# EAGLE schematic GPSTracker_v1.0 (EAGLE 7.2.0)
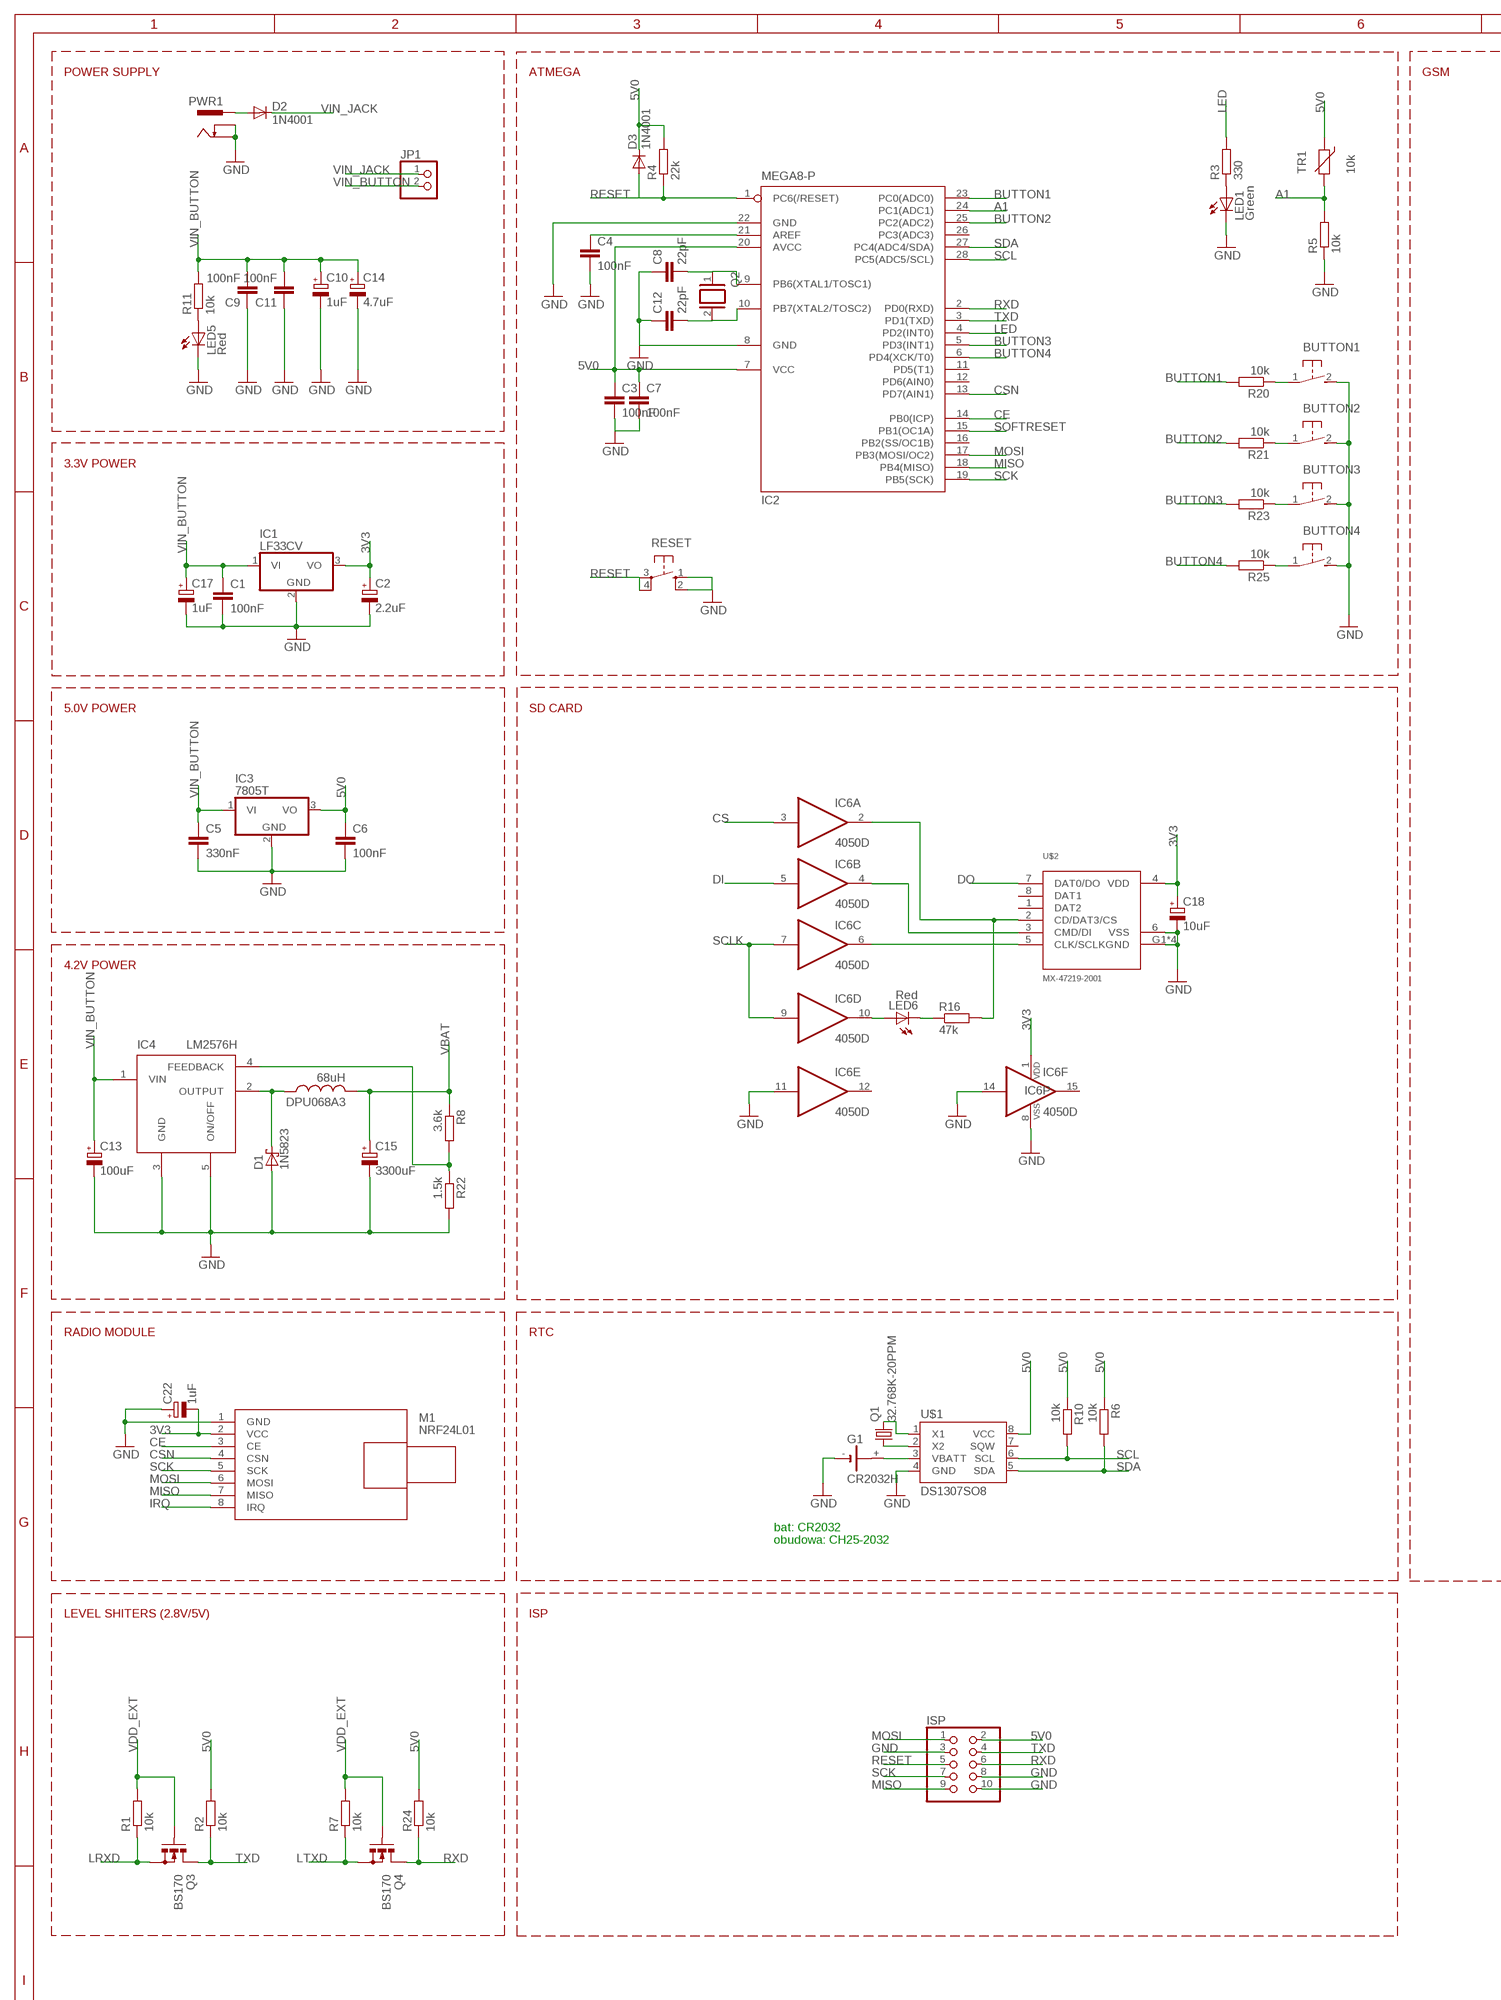
[diagram p0: schematic, sheet 1, part 1 of 2]
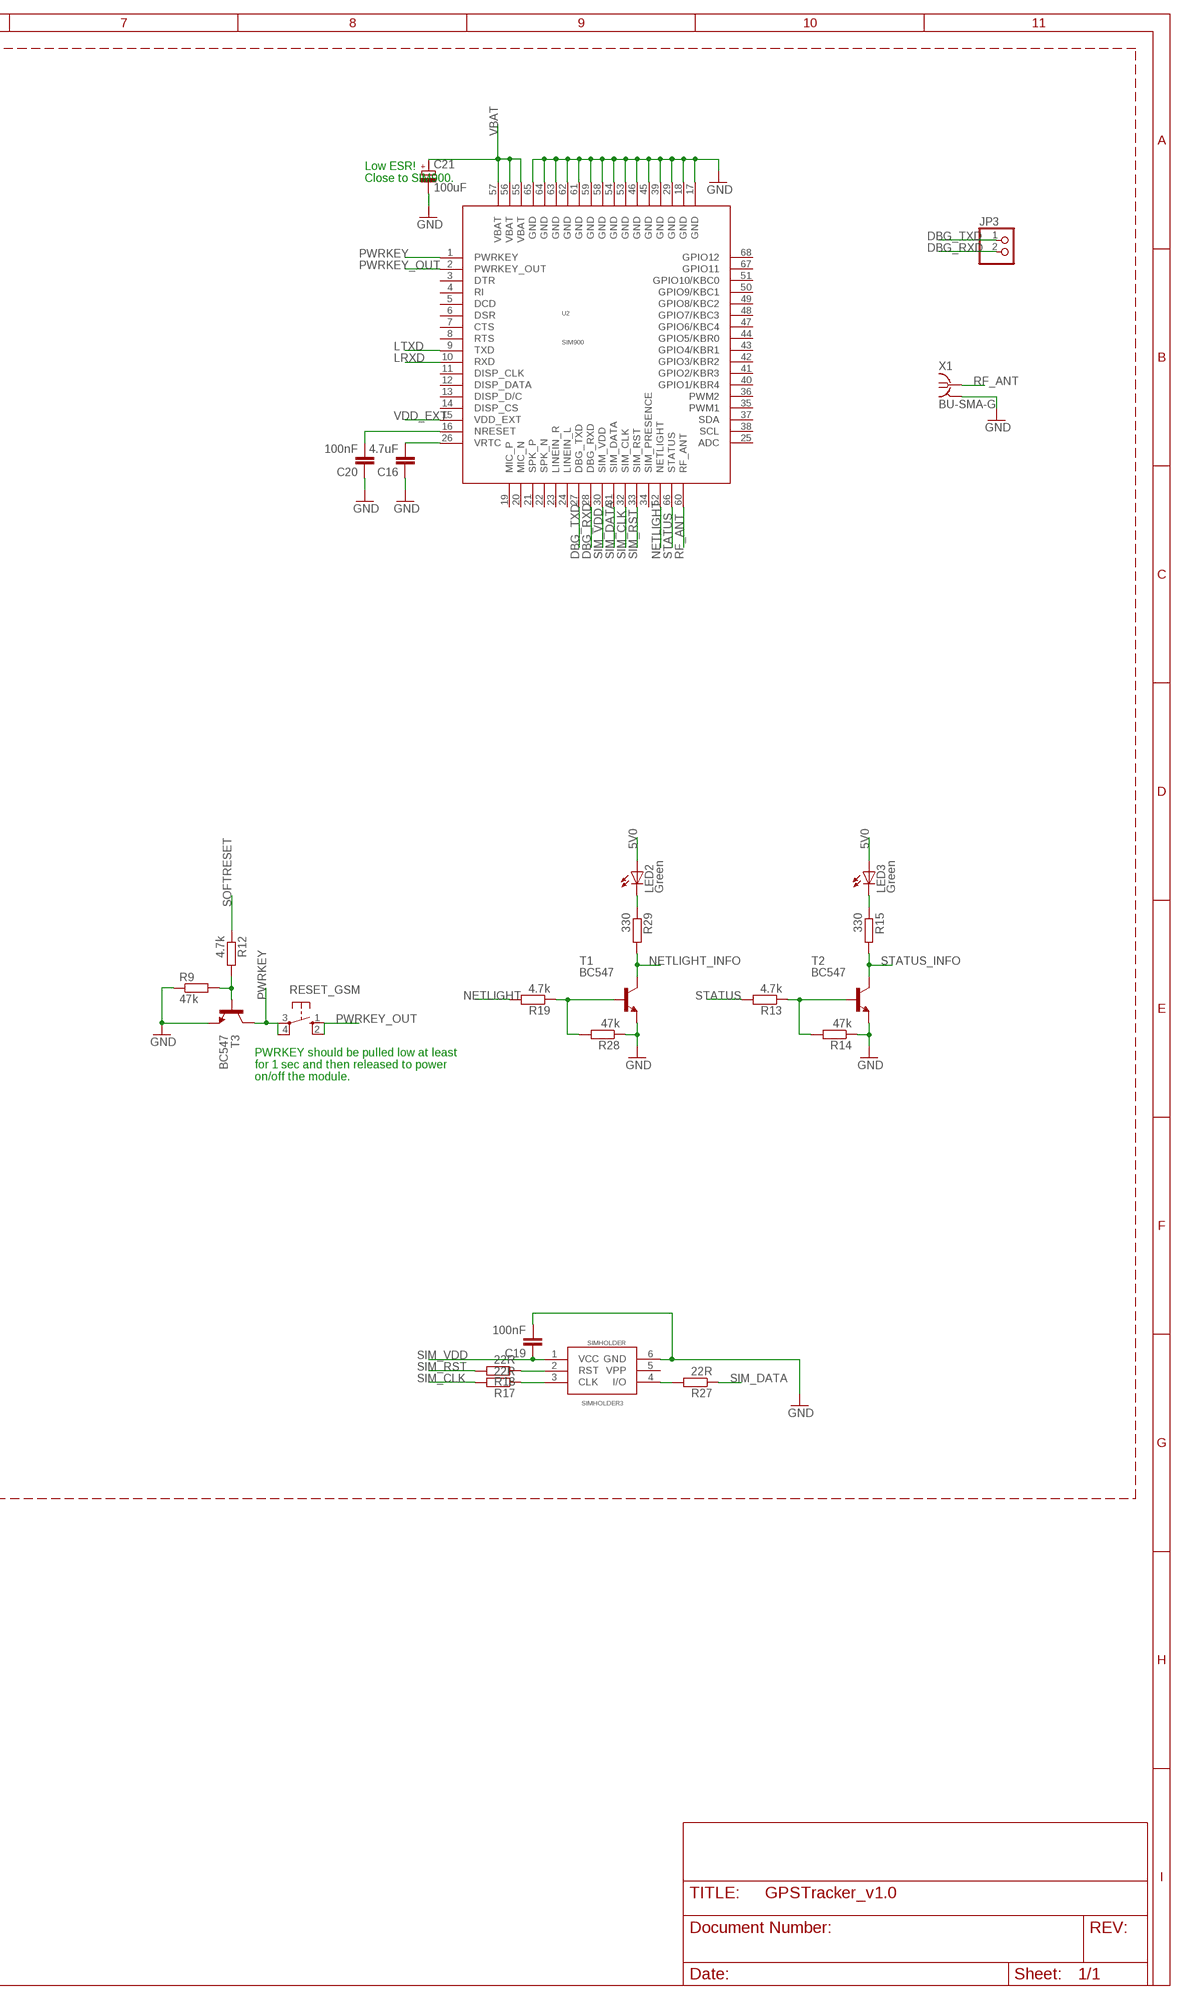
[diagram p1: schematic, sheet 1, part 2 of 2]

## Parts
BUTTON1  31-XX  [B3F-31XX]
BUTTON2  31-XX  [B3F-31XX]
BUTTON3  31-XX  [B3F-31XX]
BUTTON4  31-XX  [B3F-31XX]
C1  100nF  C-EU025-025X050  [C025-025X050]
C2  2.2uF  CPOL-EUE2.5-5  [E2,5-5]
C3  100nF  C-EU025-025X050  [C025-025X050]
C4  100nF  C-EU025-025X050  [C025-025X050]
C5  330nF  C-EU025-025X050  [C025-025X050]
C6  100nF  C-EU025-025X050  [C025-025X050]
C7  100nF  C-EU025-025X050  [C025-025X050]
C8  22pF  C-EU025-025X050  [C025-025X050]
C9  100nF  C-EU025-025X050  [C025-025X050]
C10  1uF  CPOL-EUE2.5-5  [E2,5-5]
C11  100nF  C-EU025-025X050  [C025-025X050]
C12  22pF  C-EU025-025X050  [C025-025X050]
C13  100uF  CPOL-EUE2.5-5  [E2,5-5]
C14  4.7uF  CPOL-EUE2.5-5  [E2,5-5]
C15  3300uF  CPOL-EUE5-13  [E5-13]
C16  4.7uF  C-EU025-025X050  [C025-025X050]
C17  1uF  CPOL-EUE2.5-5  [E2,5-5]
C18  10uF  CPOL-EUE2.5-5  [E2,5-5]
C19  100nF  C-EU025-025X050  [C025-025X050]
C20  100nF  C-EU025-025X050  [C025-025X050]
C21  100uF  CPOL-EUE2.5-5  [E2,5-5]
C22  1uF  CPOL-EUE2.5-5  [E2,5-5]
D1  1N5823  1N5817-B  [DO41-7.6]
D2  1N4001  1N4004  [DO41-10]
D3  1N4001  1N4004  [DO41-10]
DPU068A3  68uH  L-USTJ4-U1  [TJ4-U1]
G1  CR2032H  [CR2032H]
IC1  LF33CV  7805T  [TO220H]
IC2  MEGA8-P  [DIL28-3]
IC3  7805T  [TO220H]
IC4  LM2576H  [TO220-52]
IC6  4050D  [SO16]
ISP  PINHD-2X5  [2X05]
JP1  PINHD-1X2  [1X02]
JP3  PINHD-1X2  [1X02]
LED1  Green  LED3MM  [LED3MM]
LED2  Green  LED3MM  [LED3MM]
LED3  Green  LED3MM  [LED3MM]
LED5  Red  LED3MM  [LED3MM]
LED6  Red  LED3MM  [LED3MM]
M1  NRF24L01  WIRELESS-NRF24L01-PA-EXT  [WIRELESS-NRD24L01-PA-EXT]
PWR1  PWR-JAKPWR_JACK_UNI_MILLING  [PWR_JACK_UNI_MILLING]
Q1  32.768K-20PPM  CRYSTALTC26V  [TC26V]
Q2  XTAL/S  [QS]
Q3  BS170  [SOT54E]
Q4  BS170  [SOT54E]
R1  10k  R-EU_0207/10  [0207/10]
R2  10k  R-EU_0207/10  [0207/10]
R3  330  R-EU_0207/10  [0207/10]
R4  22k  R-EU_0207/10  [0207/10]
R5  10k  R-EU_0207/10  [0207/10]
R6  10k  R-EU_0207/10  [0207/10]
R7  10k  R-EU_0207/10  [0207/10]
R8  3.6k  R-EU_0207/10  [0207/10]
R9  47k  R-EU_0207/10  [0207/10]
R10  10k  R-EU_0207/10  [0207/10]
R11  10k  R-EU_0207/10  [0207/10]
R12  4.7k  R-EU_0207/10  [0207/10]
R13  4.7k  R-EU_0207/10  [0207/10]
R14  47k  R-EU_0207/10  [0207/10]
R15  330  R-EU_0207/10  [0207/10]
R16  47k  R-EU_0207/10  [0207/10]
R17  22R  R-EU_0207/10  [0207/10]
R18  22R  R-EU_0207/10  [0207/10]
R19  4.7k  R-EU_0207/10  [0207/10]
R20  10k  R-EU_0207/10  [0207/10]
R21  10k  R-EU_0207/10  [0207/10]
R22  1.5k  R-EU_0207/10  [0207/10]
R23  10k  R-EU_0207/10  [0207/10]
R24  10k  R-EU_0207/10  [0207/10]
R25  10k  R-EU_0207/10  [0207/10]
R27  22R  R-EU_0207/10  [0207/10]
R28  47k  R-EU_0207/10  [0207/10]
R29  330  R-EU_0207/10  [0207/10]
RESET  10-XX  [B3F-10XX]
RESET_GSM  10-XX  [B3F-10XX]
SIMHOLDER  SIMHOLDER3  [SIMHOLDER3]
T1  BC547  [TO92]
T2  BC547  [TO92]
T3  BC547  [TO92]
TR1  10k  THERMISTOR_R-2,5  [RS-2,5]
U2  SIM900  [SIM900]
U$1  DS1307SO8  [SO08]
U$2  MX-47219-2001  [MX-47219-2001]
X1  BU-SMA-G  [BU-SMA-G]

## Nets
3V3: C2.+ C18.+ C22.- IC1.3(VO) IC6.1(P:VDD) M1.2(VCC) U$2.4(VDD)
5V0: C3.1 C6.1 C7.1 D3.C IC2.7(VCC) IC2.20(AVCC) IC3.3(VO) ISP.2 LED2.A LED3.A R2.2 R4.2 R6.1 R10.1 R24.2 TR1.1 U$1.8(VCC)
A1: IC2.24(PC1(ADC1)) R5.2 TR1.2
BUTTON1: IC2.23(PC0(ADC0)) R20.2
BUTTON2: IC2.25(PC2(ADC2)) R21.2
BUTTON3: IC2.5(PD3(INT1)) R23.2
BUTTON4: IC2.6(PD4(XCK/T0)) R25.2
CE: IC2.14(PB0(ICP)) M1.3(CE)
CS: IC6.3(A:I)
CSN: IC2.13(PD7(AIN1)) M1.4(CSN)
DBG_RXD: JP3.2 U2.28(DBG_RXD)
DBG_TXD: JP3.1 U2.27(DBG_TXD)
DI: IC6.5(B:I)
DO: U$2.7(DAT0/DO)
GND: BUTTON1.2(S) BUTTON2.2(S) BUTTON3.2(S) BUTTON4.2(S) C1.2 C2.- C3.2 C4.2 C5.2 C6.2 C7.2 C8.1 C9.1 C10.- C11.1 C12.1 C13.- C14.- C15.- C16.1 C17.- C18.- C19.2 C20.1 C21.- C22.+ D1.A G1.- IC1.2(GND) IC2.8(GND) IC2.22(GND) IC3.2(GND) IC4.3(GND) IC4.5(ON/OFF) IC6.8(P:VSS) IC6.11(E:I) IC6.14(F:I) ISP.3 ISP.8 ISP.10 LED1.K(C) LED5.K(C) M1.1(GND) PWR1.- PWR1.-- R5.1 R9.1 R14.1 R22.2 R28.1 RESET.1(S) RESET.2(S1) SIMHOLDER.6(GND) T1.1(E) T2.1(E) T3.1(E) U2.17(GND) U2.18(GND) U2.29(GND) U2.39(GND) U2.45(GND) U2.46(GND) U2.53(GND) U2.54(GND) U2.58(GND) U2.59(GND) U2.61(GND) U2.62(GND) U2.63(GND) U2.64(GND) U2.65(GND) U$1.4(GND) U$2.6(VSS) U$2.G1(GND) U$2.G2(GND) U$2.G3(GND) U$2.G4(GND) X1.2 X1.3 X1.4 X1.5
IRQ: M1.8(IRQ)
LED: IC2.4(PD2(INT0)) R3.2
LRXD: Q3.S R1.1 U2.10(RXD)
LTXD: Q4.S R7.1 U2.9(TXD)
MISO: IC2.18(PB4(MISO)) ISP.9 M1.7(MISO)
MOSI: IC2.17(PB3(MOSI/OC2)) ISP.1 M1.6(MOSI)
N$1: C4.1 IC2.21(AREF)
N$2: Q1.1 U$1.2(X2)
N$3: IC4.4(FEEDBACK) R8.2 R22.1
N$4: D2.A PWR1.+
N$5: LED1.A R3.1
N$6: R27.2 SIMHOLDER.4(I/O)
N$7: LED2.K(C) R29.1
N$8: Q1.2 U$1.1(X1)
N$9: R13.1 R14.2 T2.2(B)
N$10: LED5.A R11.1
N$11: LED3.K(C) R15.1
N$12: D1.C DPU068A3.1 IC4.2(OUTPUT)
N$13: C20.2 U2.16(NRESET)
N$14: R9.2 R12.2 T3.2(B)
N$15: R19.1 R28.2 T1.2(B)
N$16: G1.+ U$1.3(VBATT)
N$17: C16.2 U2.26(VRTC)
N$18: BUTTON1.1(P) R20.1
N$19: BUTTON2.1(P) R21.1
N$20: BUTTON3.1(P) R23.1
N$21: BUTTON4.1(P) R25.1
N$24: R18.1 SIMHOLDER.2(RST)
N$25: R17.1 SIMHOLDER.3(CLK)
N$26: IC6.2(A:O) R16.2 U$2.2(CD/DAT3/CS)
N$27: IC6.4(B:O) U$2.3(CMD/DI)
N$29: C8.2 IC2.9(PB6(XTAL1/TOSC1)) Q2.1
N$30: IC6.6(C:O) U$2.5(CLK/SCLK)
N$31: IC6.10(D:O) LED6.A
N$32: LED6.K(C) R16.1
N$35: C12.2 IC2.10(PB7(XTAL2/TOSC2)) Q2.2
NETLIGHT: R19.2 U2.52(NETLIGHT)
NETLIGHT_INFO: R29.2 T1.3(C)
PWRKEY: RESET_GSM.3(P) RESET_GSM.4(P1) T3.3(C) U2.1(PWRKEY)
PWRKEY_OUT: RESET_GSM.1(S) RESET_GSM.2(S1) U2.2(PWRKEY_OUT)
RESET: D3.A IC2.1(PC6(/RESET)) ISP.5 R4.1 RESET.3(P) RESET.4(P1)
RF_ANT: U2.60(RF_ANT) X1.1
RXD: IC2.2(PD0(RXD)) ISP.6 Q4.D R24.1
SCK: IC2.19(PB5(SCK)) ISP.7 M1.5(SCK)
SCL: IC2.28(PC5(ADC5/SCL)) R10.2 U$1.6(SCL)
SCLK: IC6.7(C:I) IC6.9(D:I)
SDA: IC2.27(PC4(ADC4/SDA)) R6.2 U$1.5(SDA)
SIM_CLK: R17.2 U2.32(SIM_CLK)
SIM_DATA: R27.1 U2.31(SIM_DATA)
SIM_RST: R18.2 U2.33(SIM_RST)
SIM_VDD: C19.1 SIMHOLDER.1(VCC) U2.30(SIM_VDD)
SOFTRESET: IC2.15(PB1(OC1A)) R12.1
STATUS: R13.2 U2.66(STATUS)
STATUS_INFO: R15.2 T2.3(C)
TXD: IC2.3(PD1(TXD)) ISP.4 Q3.D R2.1
VBAT: C15.+ C21.+ DPU068A3.2 R8.1 U2.55(VBAT) U2.56(VBAT) U2.57(VBAT)
VDD_EXT: Q3.G Q4.G R1.2 R7.2 U2.15(VDD_EXT)
VIN_BUTTON: C1.1 C5.1 C9.2 C10.+ C11.2 C13.+ C14.+ C17.+ IC1.1(VI) IC3.1(VI) IC4.1(VIN) JP1.2 R11.2
VIN_JACK: D2.C JP1.1
Unconnected: IC2.11(PD5(T1)) IC2.12(PD6(AIN0)) IC2.16(PB2(SS/OC1B)) IC2.26(PC3(ADC3)) IC6.12(E:O) IC6.15(F:O) SIMHOLDER.5(VPP) U2.3(DTR) U2.4(RI) U2.5(DCD) U2.6(DSR) U2.7(CTS) U2.8(RTS) U2.11(DISP_CLK) U2.12(DISP_DATA) U2.13(DISP_D/C) U2.14(DISP_CS) U2.19(MIC_P) U2.20(MIC_N) U2.21(SPK_P) U2.22(SPK_N) U2.23(LINEIN_R) U2.24(LINEIN_L) U2.25(ADC) U2.34(SIM_PRESENCE) U2.35(PWM1) U2.36(PWM2) U2.37(SDA) U2.38(SCL) U2.40(GPIO1/KBR4) U2.41(GPIO2/KBR3) U2.42(GPIO3/KBR2) U2.43(GPIO4/KBR1) U2.44(GPIO5/KBR0) U2.47(GPIO6/KBC4) U2.48(GPIO7/KBC3) U2.49(GPIO8/KBC2) U2.50(GPIO9/KBC1) U2.51(GPIO10/KBC0) U2.67(GPIO11) U2.68(GPIO12) U$1.7(SQW) U$2.1(DAT2) U$2.8(DAT1)

## Notes on the sheet
- POWER SUPPLY | ATMEGA | GSM
- Low ESR!
  Close to SIM900.
- 3.3V POWER
- 5.0V POWER | SD CARD
- 4.2V POWER
- PWRKEY should be pulled low at least 
  for 1 sec and then released to power 
  on/off the module.
- RADIO MODULE | RTC
- bat: CR2032
  obudowa: CH25-2032
- LEVEL SHITERS (2.8V/5V) | ISP

## Library data of the parts
BUTTON1-BUTTON4 = switch-omron:31-XX: OMRON SWITCH; MPN: B3F-3100; OC_FARNELL: 959704; OC_NEWARK: 36M3582
C1 C3-C9 C11 C12 C16 C19 C20 = rcl:C-EU: CAPACITOR, European symbol
C2 C10 C13-C15 C17 C18 C21 C22 = rcl:CPOL-EU: POLARIZED CAPACITOR, European symbol
D1 = diode:1N581*: 1.0A SCHOTTKY BARRIER RECTIFIER Source: http://www.diodes.com/datasheets/ds23001.pdf
D2 D3 = diode:1N4004: DIODE general purpose rectifier, 1 A
DPU068A3 = rcl:L-US: INDUCTOR, American symbol
G1 = hosho:CR2032H: LI BATTERY Varta
IC1 IC3 = linear:78*: Positive VOLTAGE REGULATOR Source: http://cache.national.com/ds/LM/LM78L05.pdf http://www.fairchildsemi.com/ds/LM/LM7805.pdf
IC2 = atmel:MEGA8-P: MICROCONTROLLER 8 Kbytes FLASH, 1 kbytes SRAM, 512 bytes EEPROM, USART, 4-channel 10 bit ADC, 2-channel 8 bit ADC Pin compatible with Atmega48, ATMega88, ATMega168 Source: avr.lbr; OC_FARNELL: unknown; OC_NEWARK: unknown
IC4 = hosho:LM2576H
IC6 = 40xx:4050: Hex non-inverting BUFFER
ISP = pinhead:PINHD-2X5: PIN HEADER
JP1 JP3 = pinhead:PINHD-1X2: PIN HEADER
LED1-LED3 LED5 LED6 = led:LED: LED OSRAM: - CHIPLED LG R971, LG N971, LY N971, LG Q971, LY Q971, LO R971, LY R971 LH N974, LH R974 LS Q976, LO Q976, LY Q976 LO Q996 - Hyper CHIPLED LW Q18S LB Q993, LB Q99A, LB R99A - SideLED LS A670, LO A670, LY A670, LG A670, LP A670 LB A673, LV A673, LT A673, LW A673 LH A674 LY A675 LS A676, LA A676, LO A676, LY A676, LW A676 LS A679, LY A679, LG A679 - Hyper Micro SIDELED® LS Y876, LA Y876, LO Y876, LY Y876 LT Y87S - SmartLED LW L88C, LW L88S LB L89C, LB L89S, LG L890 LS L89K, LO L89K, LY L89K LS L896, LA L896, LO L896, LY L896 - TOPLED LS T670, LO T670, LY T670, LG T670, LP T670 LSG T670, LSP T670, LSY T670, LOP T670, LYG T670 LG T671, LOG T671, LSG T671 LB T673, LV T673, LT T673, LW T673 LH T674 LS T676, LA T676, LO T676, LY T676, LB T676, LH T676, LSB T676, LW T676 LB T67C, LV T67C, LT T67C, LS T67K, LO T67K, LY T67K, LW E67C LS E67B, LA E67B, LO E67B, LY E67B, LB E67C, LV E67C, LT E67C LW T67C LS T679, LY T679, LG T679 LS T770, LO T770, LY T770, LG T770, LP T770 LB T773, LV T773, LT T773, LW T773 LH T774 LS E675, LA E675, LY E675, LS T675 LS T776, LA T776, LO T776, LY T776, LB T776 LHGB T686 LT T68C, LB T68C - Hyper Mini TOPLED® LB M676 - Mini TOPLED Santana® LG M470 LS M47K, LO M47K, LY M47K Source: http://www.osram.convergy.de LUXEON: - LUMILED® LXK2-PW12-R00, LXK2-PW12-S00, LXK2-PW14-U00, LXK2-PW14-V00 LXK2-PM12-R00, LXK2-PM12-S00, LXK2-PM14-U00 LXK2-PE12-Q00, LXK2-PE12-R00, LXK2-PE12-S00, LXK2-PE14-T00, LXK2-PE14-U00 LXK2-PB12-K00, LXK2-PB12-L00, LXK2-PB12-M00, LXK2-PB14-N00, LXK2-PB14-P00, LXK2-PB14-Q00 LXK2-PR12-L00, LXK2-PR12-M00, LXK2-PR14-Q00, LXK2-PR14-R00 LXK2-PD12-Q00, LXK2-PD12-R00, LXK2-PD12-S00 LXK2-PH12-R00, LXK2-PH12-S00 LXK2-PL12-P00, LXK2-PL12-Q00, LXK2-PL12-R00 Source: www.luxeon.com KINGBRIGHT: KA-3528ASYC Source: www.kingbright.com
M1 = diy-modules:WIRELESS-NRF24L01-PA-EXT: 2.4 GHz Wireless Module based on NRF24L01 chip with preamplifier and external antenna
PWR1 = iMX233-OLINUXINO-MAXI_Rev_D:PWR-JAK
Q1 = crystal:CRYSTAL: CRYSTAL; OC_FARNELL: unknown; OC_NEWARK: unknown
Q2 = special:XTAL/S: CRYSTAL
Q3 Q4 = transistor-small-signal:BS170: N-CHANNEL MOS FET
R1-R25 R27-R29 = rcl:R-EU_: RESISTOR, European symbol
RESET RESET_GSM = switch-omron:10-XX: OMRON SWITCH; MPN: B3F-1000; OC_FARNELL: 176432; OC_NEWARK: 36M3542
SIMHOLDER = SparkFun2:SIMHOLDER3
T1-T3 = transistor:BC547: NPN TRANSISTOR
TR1 = discrete:THERMISTOR_: Thermo Resistor
U2 = ICs_v54:SIM900
U$1 = SparkFun-FreqCtrl:DS1307: I2C real-time clock with battery backup.
U$2 = hosho:MX-47219-2001
X1 = hosho:BU-SMA-G: FEMALE SMA CONNECTOR Radiall distributor RS 193-9117; OC_FARNELL: unknown; OC_NEWARK: unknown